# EAGLE schematic deck (EAGLE 9.6.2)
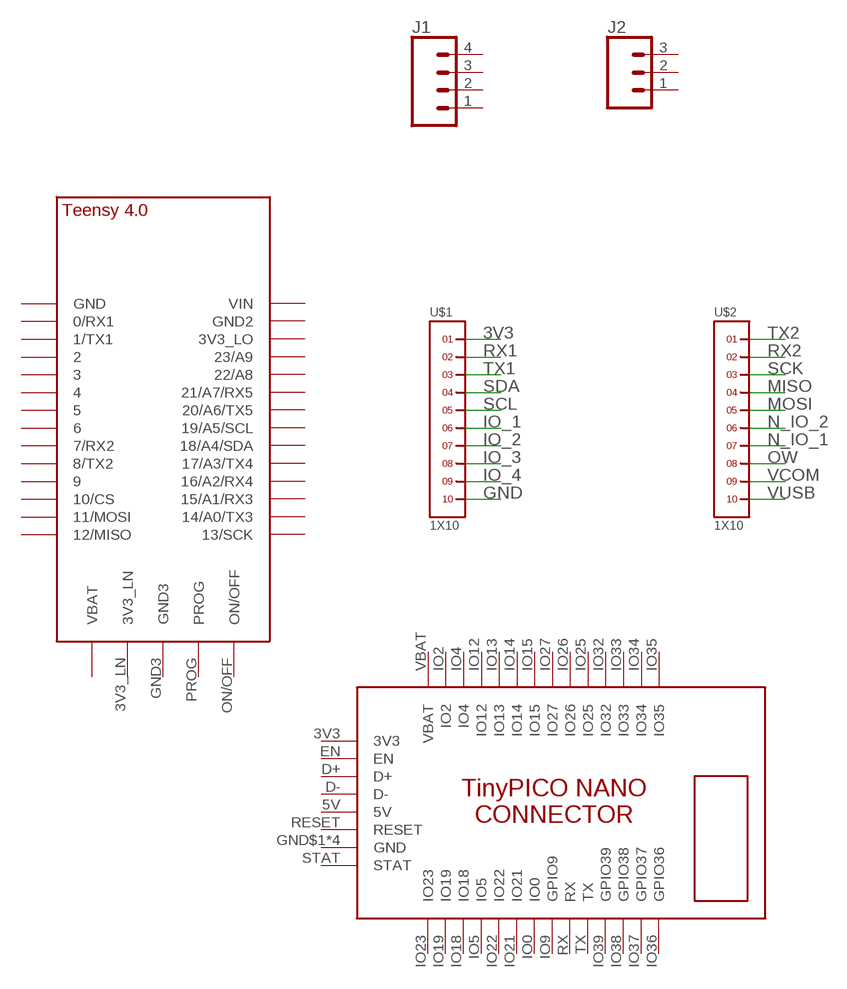
[diagram p0: schematic, sheet 1]

## Parts
J1  CONN_041X04_NO_SILK  [1X04_NO_SILK]
J2  CONN_031X03_NO_SILK  [1X03_NO_SILK]
U$1  1X10  [1X10]
U$2  1X10  [1X10]
U$3  TEENSY_4.0  [TEENSY_4.0]
U$4  TINYPICO-NANO-CONNECTOR  [TINYPICO-NANO-CONNECTOR]

## Nets
3V3: U$1.1
GND: U$1.10
IO_1: U$1.6
IO_2: U$1.7
IO_3: U$1.8
IO_4: U$1.9
MISO: U$2.4
MOSI: U$2.5
N_IO_1: U$2.7
N_IO_2: U$2.6
OW: U$2.8
RX1: U$1.2
RX2: U$2.2
SCK: U$2.3
SCL: U$1.5
SDA: U$1.4
TX1: U$1.3
TX2: U$2.1
VCOM: U$2.9
VUSB: U$2.10
Unconnected: J1.1 J1.2 J1.3 J1.4 J2.1 J2.2 J2.3 U$3.0/RX(0/RX1) U$3.1/TX(1/TX1) U$3.2 U$3.3/CANTX U$3.3V3_LN U$3.3V3_LO U$3.4/CANRX U$3.5 U$3.6 U$3.7(7/RX2) U$3.8(8/TX2) U$3.9/CS U$3.10/CS U$3.11/MOSI U$3.12/MISO U$3.13/SCK U$3.14/A0(14/A0/TX3) U$3.15/A1(15/A1/RX3) U$3.16/A2(16/A2/RX4) U$3.17/A3(17/A3/TX4) U$3.18/A4/SDA U$3.19/A5/SCL U$3.20/A6(20/A6/TX5) U$3.21/A7(21/A7/RX5) U$3.22/A8 U$3.23/A9 U$3.GND U$3.GND2 U$3.GND3 U$3.ON/OFF U$3.PROG U$3.VBAT\(VBAT) U$3.VIN U$4.D+ U$4.D- U$4.EN U$4.IO0 U$4.IO2 U$4.IO4 U$4.IO5 U$4.IO9(GPIO9) U$4.IO12 U$4.IO13 U$4.IO14 U$4.IO15 U$4.IO18 U$4.IO19 U$4.IO21 U$4.IO22 U$4.IO23 U$4.IO25 U$4.IO26 U$4.IO27 U$4.IO32 U$4.IO33 U$4.IO34 U$4.IO35 U$4.IO36(GPIO36) U$4.IO37(GPIO37) U$4.IO38(GPIO38) U$4.IO39(GPIO39) U$4.RESET U$4.RX U$4.STAT U$4.TX

## Power pins joined to a net without a drawn wire
3V3: U$4.3V3
5V: U$4.5V
GND: U$4.GND$1(GND) U$4.GND$2(GND) U$4.GND$3(GND) U$4.GND$4(GND)
VBAT: U$4.VBAT

## Library data of the parts
J1 = SparkFun-Connectors:CONN_04: Multi connection point. Often used as Generic Header-pin footprint for 0.1 inch spaced/style header connections On any of the 0.1 inch spaced packages, you can populate with these: Break Away Headers - Straight <https://www.sparkfun.com/products/116> (PRT-00116) Break Away Male Headers - Right Angle <https://www.sparkfun.com/products/553> (PRT-00553) Female Headers <https://www.sparkfun.com/products/115> (PRT-00115) Break Away Headers - Machine Pin <https://www.sparkfun.com/products/117> (PRT-00117) Break Away Female Headers - Swiss Machine Pin <https://www.sparkfun.com/products/743> (PRT-00743) For SCREWTERMINALS and SPRING TERMINALS visit here: Screw Terimnals on SparkFun.com <https://www.sparkfun.com/search/results?term=Screw+Terminals> (5mm/3.5mm/2.54mm spacing) This device is also useful as a general connection point to wire up your design to another part of your project. Our various solder wires solder well into these plated through hole pads. Hook-Up Wire - Assortment (Stranded, 22 AWG) <https://www.sparkfun.com/products/11375> (PRT-11375) Hook-Up Wire - Assortment (Solid Core, 22 AWG) <https://www.sparkfun.com/products/11367> (PRT-11367) View the entire wire category on our website here <https://www.sparkfun.com/categories/141> Special notes: Molex polarized connector foot print use with SKU : PRT-08231 with associated crimp pins and housings. 1MM SMD Version SKU: PRT-10208; PROD_ID: CONN-09696
J2 = SparkFun-Connectors:CONN_03: Multi connection point. Often used as Generic Header-pin footprint for 0.1 inch spaced/style header connections On any of the 0.1 inch spaced packages, you can populate with these: Break Away Headers - Straight <https://www.sparkfun.com/products/116> (PRT-00116) Break Away Male Headers - Right Angle <https://www.sparkfun.com/products/553> (PRT-00553) Female Headers <https://www.sparkfun.com/products/115> (PRT-00115) Break Away Headers - Machine Pin <https://www.sparkfun.com/products/117> (PRT-00117) Break Away Female Headers - Swiss Machine Pin <https://www.sparkfun.com/products/743> (PRT-00743) Stackable Header - 3 Pin (Female, 0.1") <https://www.sparkfun.com/products/13875> (PRT-13875) For SCREWTERMINALS and SPRING TERMINALS visit here: Screw Terimnals on SparkFun.com <https://www.sparkfun.com/search/results?term=Screw+Terminals> (5mm/3.5mm/2.54mm spacing) This device is also useful as a general connection point to wire up your design to another part of your project. Our various solder wires solder well into these plated through hole pads. Hook-Up Wire - Assortment (Stranded, 22 AWG) <https://www.sparkfun.com/products/11375> (PRT-11375) Hook-Up Wire - Assortment (Solid Core, 22 AWG) <https://www.sparkfun.com/products/11367> (PRT-11367) View the entire wire category on our website here <https://www.sparkfun.com/categories/141> Special notes: Molex polarized connector foot print use with SKU : PRT-08232 with associated crimp pins and housings.
U$1 U$2 = headers(2mm):1X10
U$3 = TEENSY 4.0:TEENSY_4.0
U$4 = TinyPICO_NANO_Eagle:TINYPICO-NANO-CONNECTOR: TinyPICO NANO Footprint https://www.tinypico.com/tinypico-nano